# Altium project 练一练2.PrjPcb
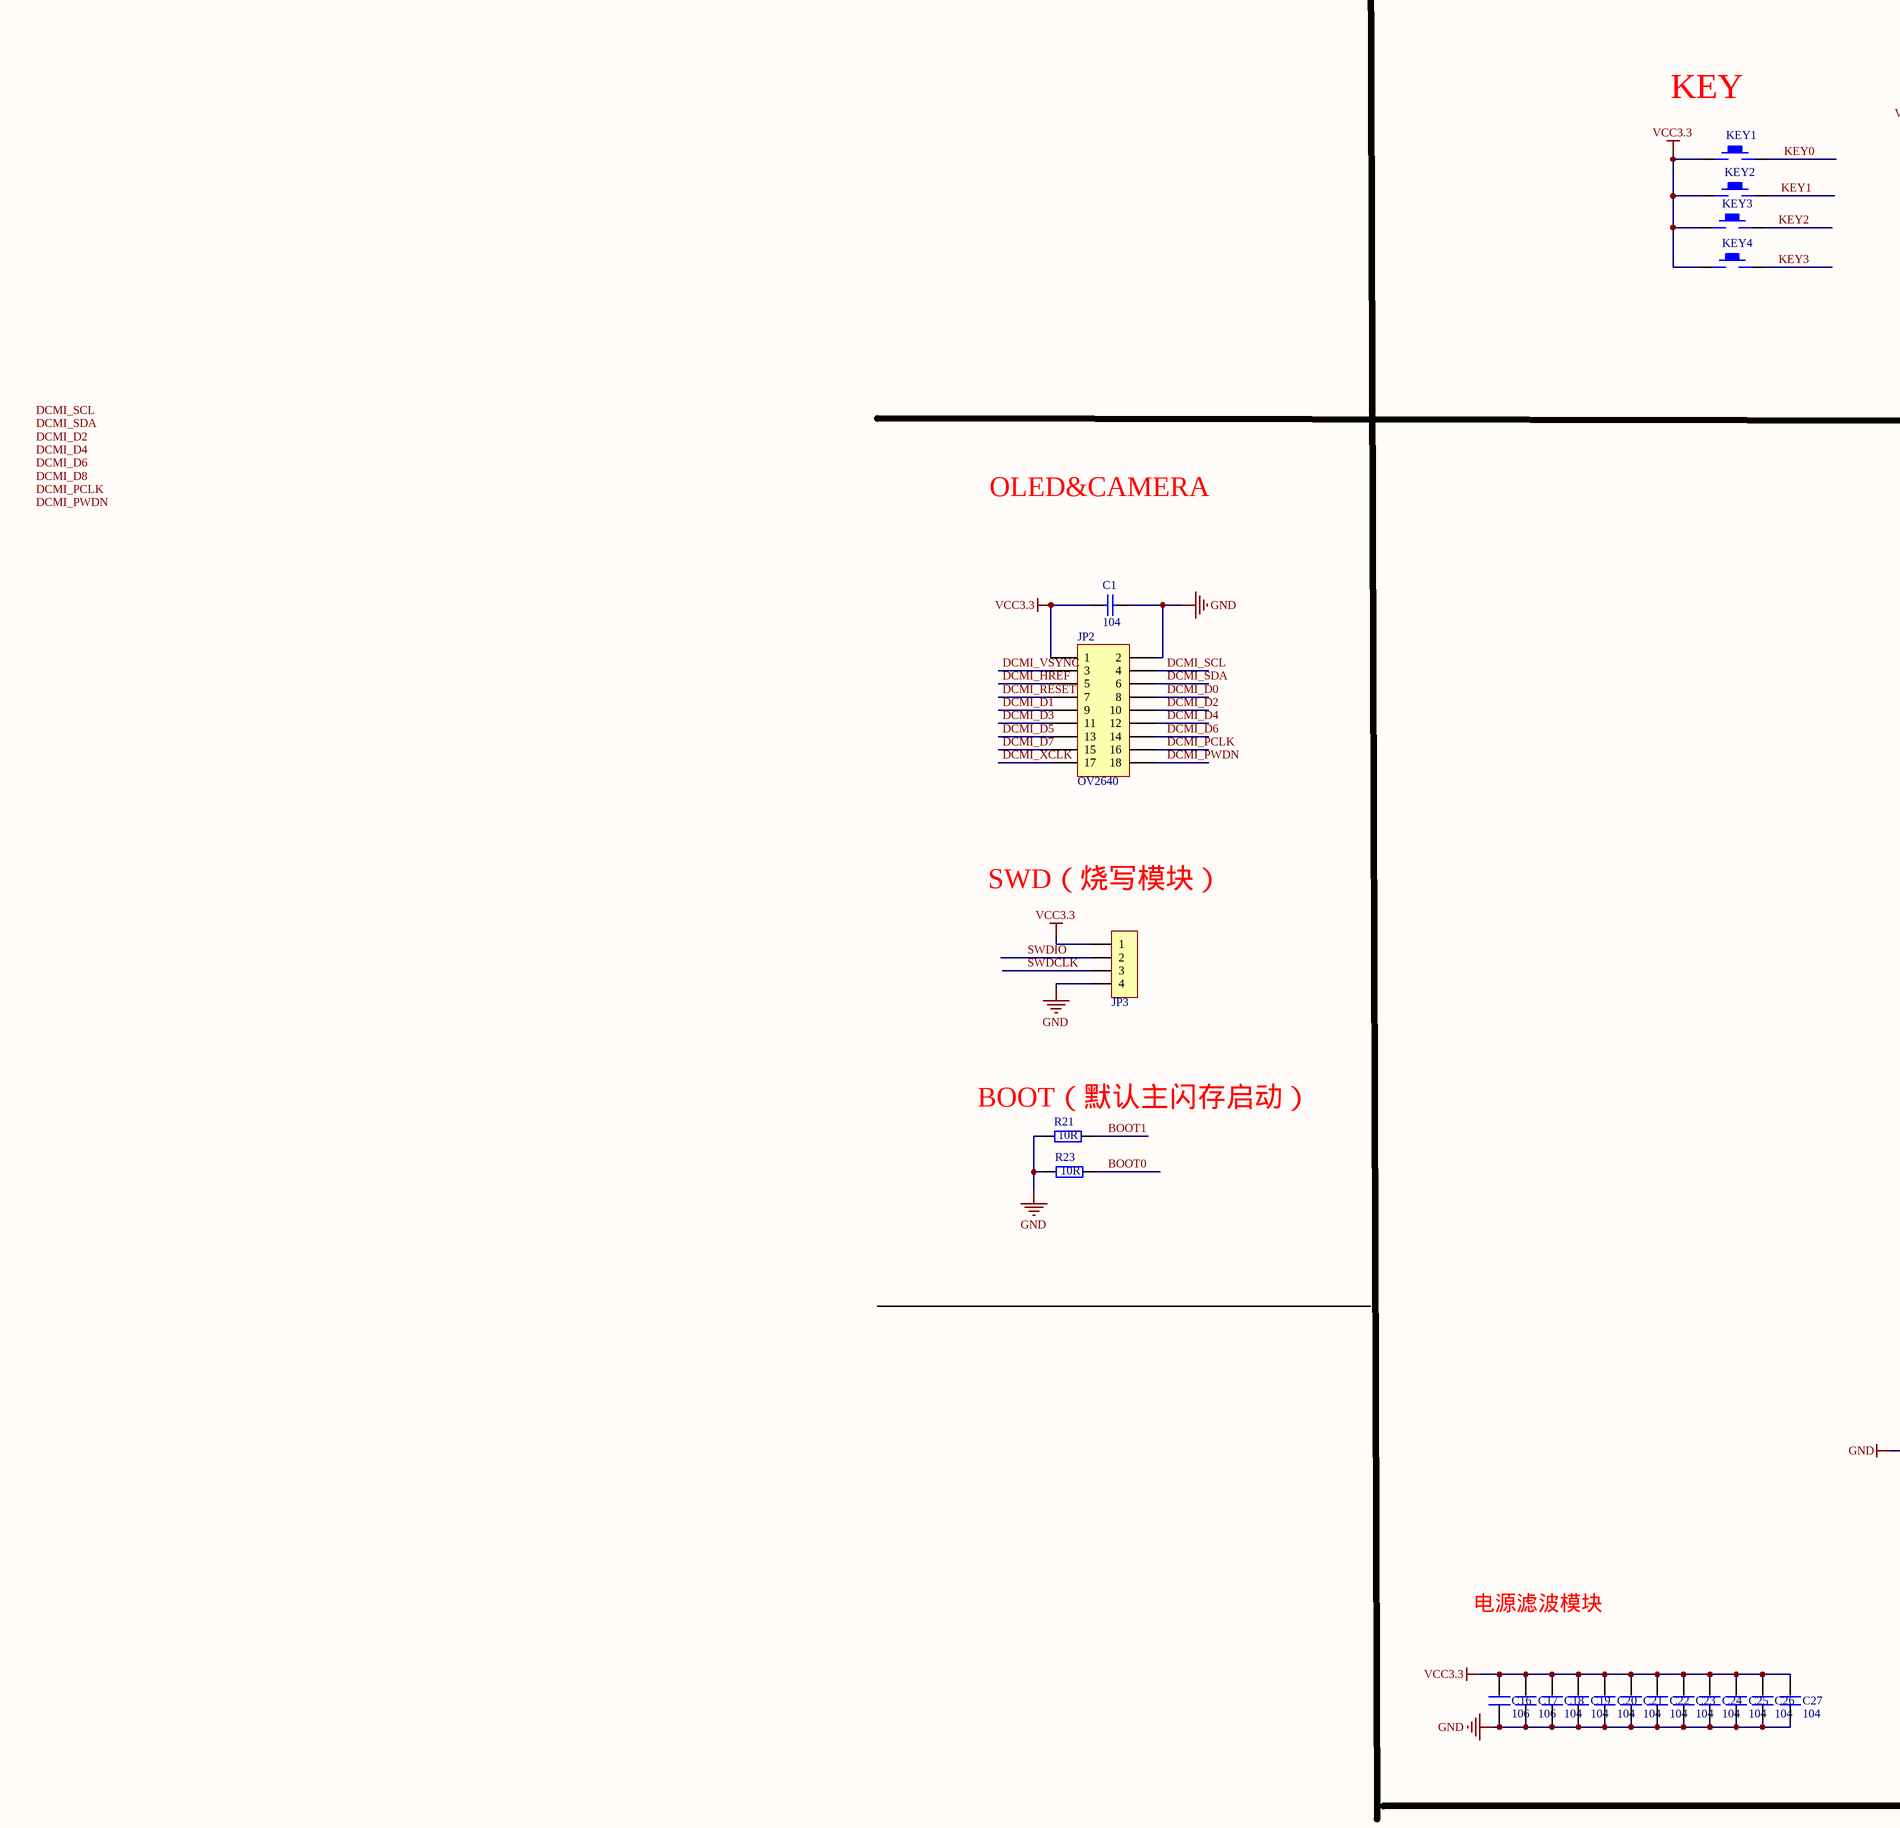
[diagram p0: 练一练2.SchDoc, left]
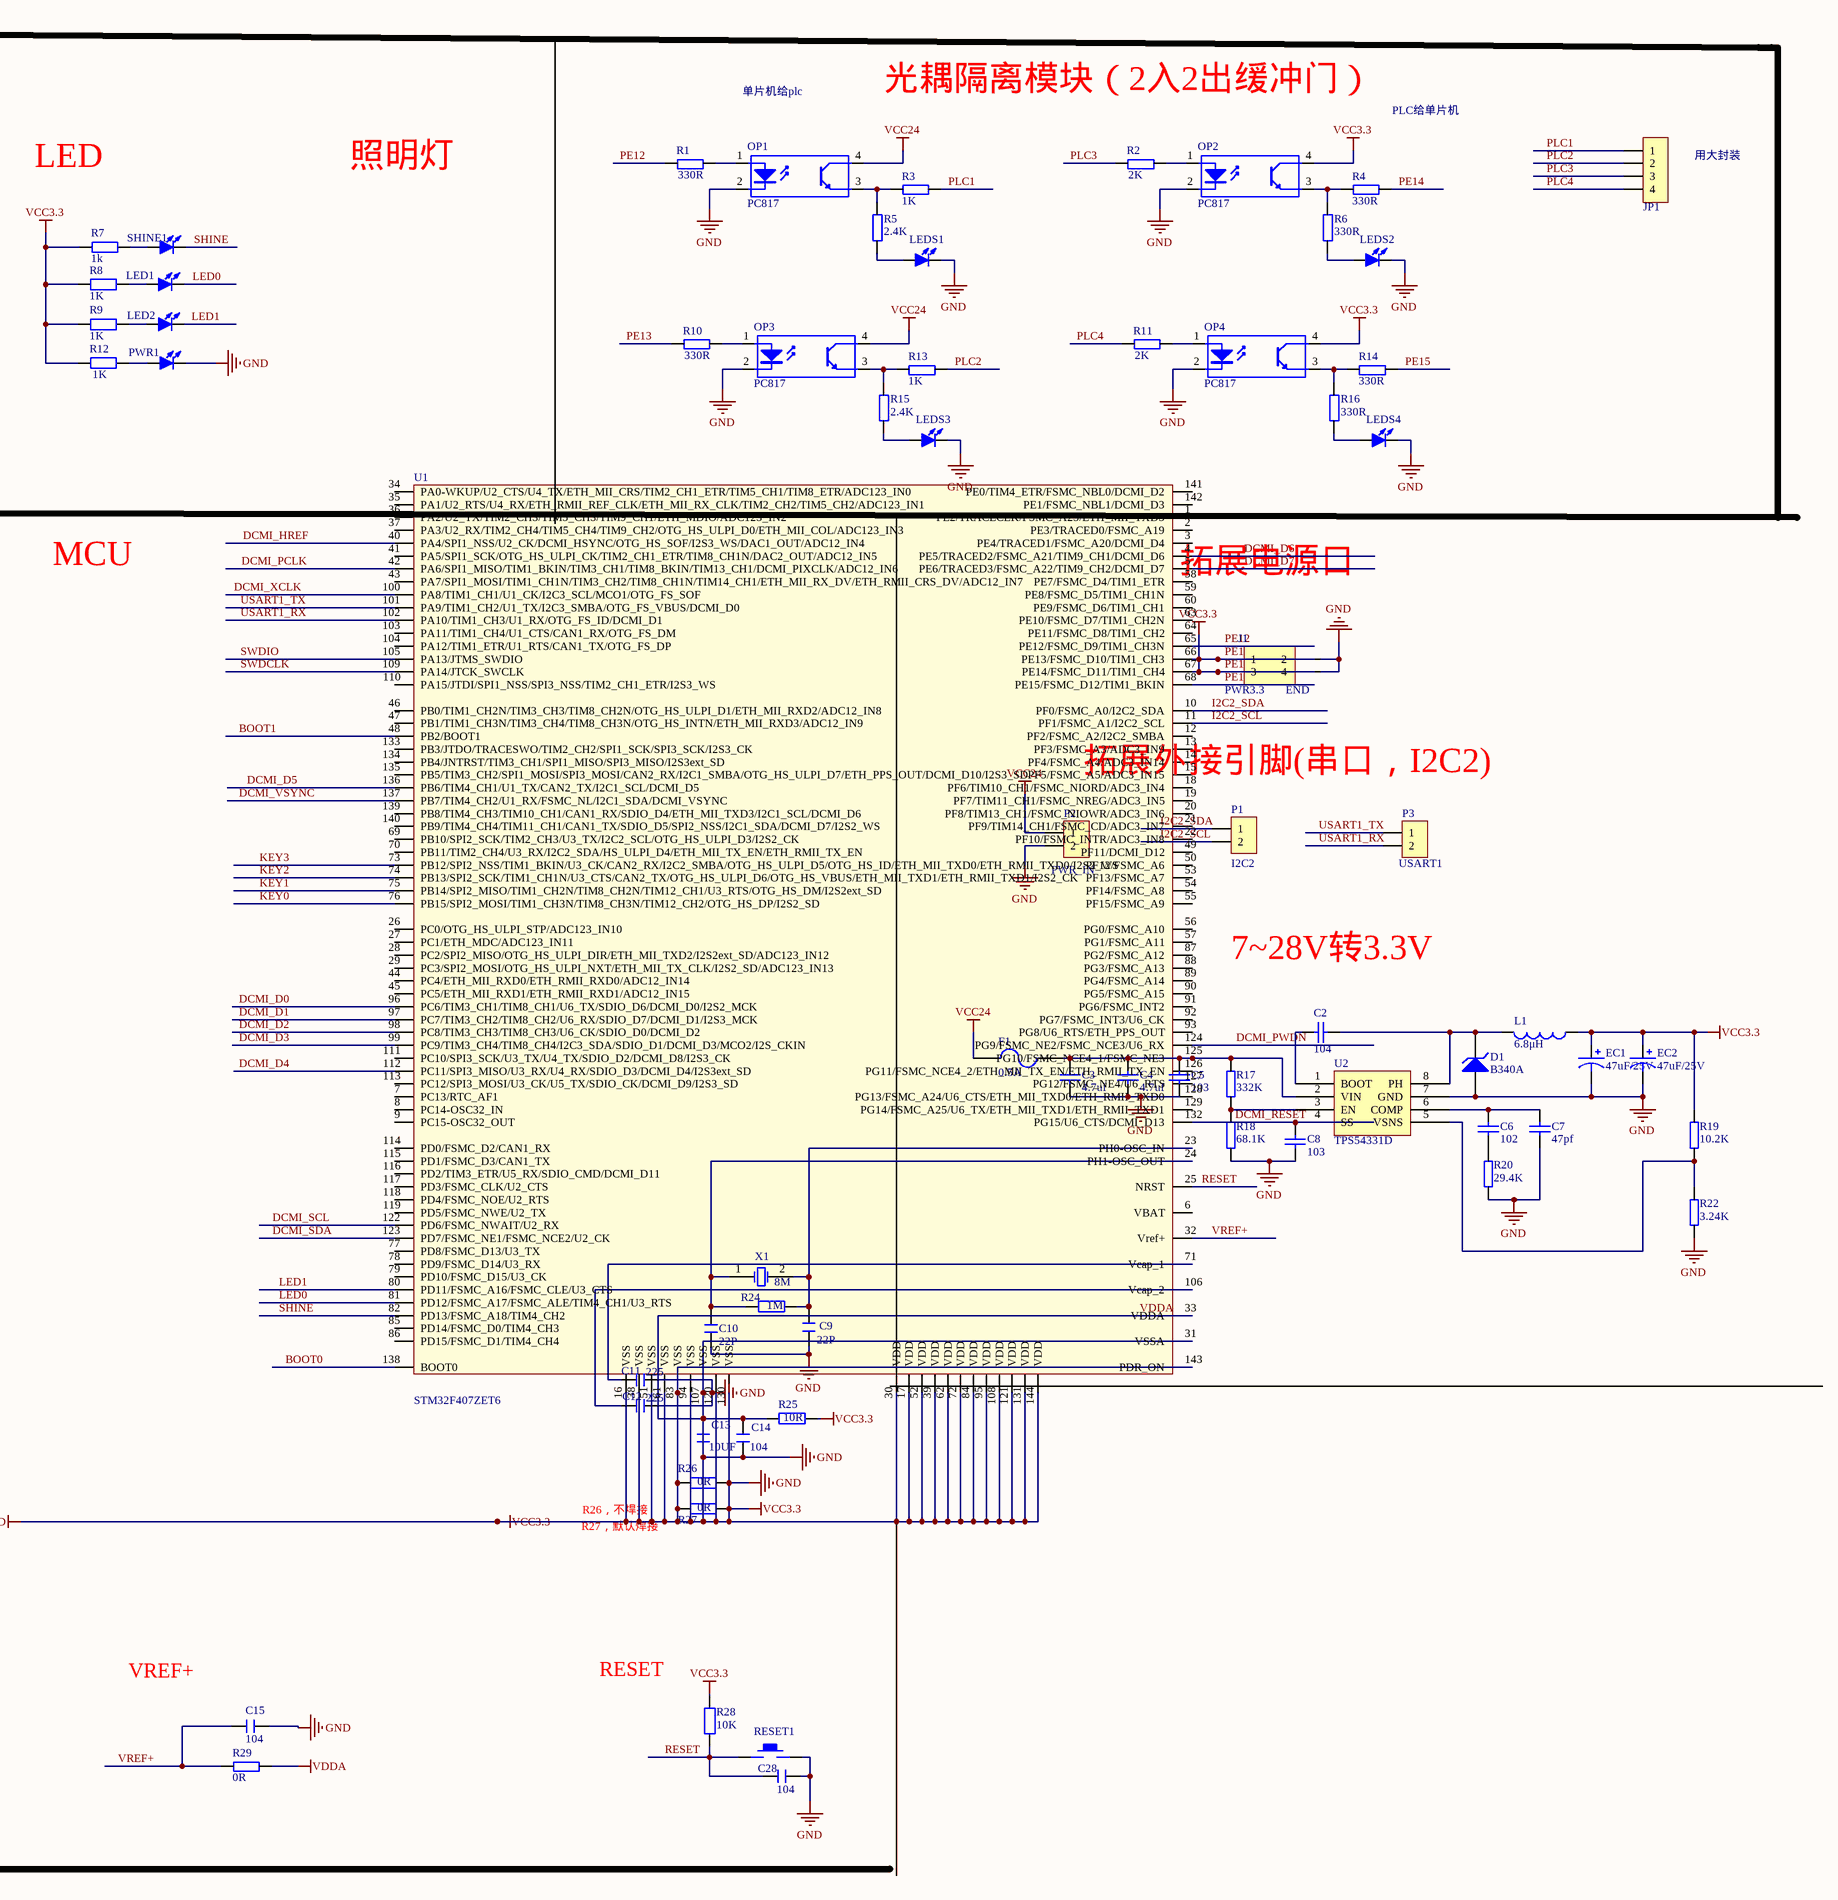
[diagram p1: 练一练2.SchDoc, right]
1 sheet, 89 parts. Net scope: global (net labels, ports and power ports of the same name join across sheets).
Board file: 练一练2.PcbDoc

## Sheet 练一练2.SchDoc
size A2

### Parts
C1  104  [C0805]
C2  104  [C0805]
C3  4.7uf  [C0805]
C4  4.7uf  [C0805]
C5  103  [C0805]
C6  102  [C0805]
C7  47pf  [C0805]
C8  103  [C0805]
C9  22P  [C 0805]
C10  22P  [C 0805]
C11  225  [C 0805]
C12  225  [C 0805]
C13  10UF  [C 0805]
C14  104  [C 0805]
C15  104  [C 0805]
C16  106  [C 0805]
C17  106  [C 0805]
C18  104  [C 0805]
C19  104  [C 0805]
C20  104  [C 0805]
C21  104  [C 0805]
C22  104  [C 0805]
C23  104  [C 0805]
C24  104  [C 0805]
C25  104  [C 0805]
C26  104  [C 0805]
C27  104  [C 0805]
C28  104  [C 0805]
D1  B340A  [SMA]
EC1  47uF/25V  [C-7]
EC2  47uF/25V  [C-7]
F1  0.5A  [FUSE0.5A]
J1  PWR3.3       END  [HDR2X2]
JP1  SWD  [IDC1X4-5.08]  (value not drawn)
JP2  OV2640  [HDR2X9]
JP3  SWD  [HDR1X4]  (value not drawn)
KEY1  KEY_M  [KEY-SMD1]  (value not drawn)
KEY2  KEY_M  [KEY-SMD1]  (value not drawn)
KEY3  KEY_M  [KEY-SMD1]  (value not drawn)
KEY4  KEY_M  [KEY-SMD1]  (value not drawn)
L1  6.8μH  [Hunter]
LED1  (no value)  [LED0805]
LED2  (no value)  [LED0805]
LEDS1  (no value)  [LED0805]
LEDS2  (no value)  [LED0805]
LEDS3  (no value)  [LED0805]
LEDS4  (no value)  [LED0805]
OP1  PC817  [SMD-4]
OP2  PC817  [SMD-4]
OP3  PC817  [SMD-4]
OP4  PC817  [SMD-4]
P1  I2C2  [HDR1X2]
P2  PWR_IN  [IDC1X2-5.08]
P3  USART1  [HDR1X2]
PWR1  (no value)  [LED0805]
R1  330R  [R0805]
R2  2K  [R0805]
R3  1K  [R0805]
R4  330R  [R0805]
R5  2.4K  [R0805]
R6  330R  [R0805]
R7  1k  [R0805]
R8  1K  [R0805]
R9  1K  [R0805]
R10  330R  [R0805]
R11  2K  [R0805]
R12  1K  [R 0805]
R13  1K  [R0805]
R14  330R  [R0805]
R15  2.4K  [R0805]
R16  330R  [R0805]
R17  332K  [R0805]
R18  68.1K  [R 0805]
R19  10.2K  [R 0805]
R20  29.4K  [R 0805]
R21  10R  [R 0805]
R22  3.24K  [R0805]
R23  10R  [R 0805]
R24  1M  [R 0805]
R25  10R  [R 0805]
R26  0R  [R 0805]
R27  0R  [R 0805]
R28  10K  [R 0805]
R29  0R  [R 0805]
RESET1  KEY_M  [KEY-SMD1]  (value not drawn)
SHINE1  (no value)  [LED0805]
U1  STM32F407ZET6  [LQFP144 20X20_M]
U2  TPS54331D  [SOP8DCDC]
X1  8M  [49/S_N]

### Nets
PE13: C1.1 C1.2 C3.2 C4.2 C5.2 C7.2 C8.2 C9.1 C10.1 C11.2 C12.2 C13.1 C13.2 C14.1 C14.2 C15.1 C16.1 C16.2 C17.1 C17.2 C18.1 C18.2 C19.1 C19.2 C20.1 C20.2 C21.1 C21.2 C22.1 C22.2 C23.1 C23.2 C24.1 C24.2 C25.1 C25.2 C26.1 C26.2 C27.1 C27.2 C28.1 D1.1(A) EC1.1 EC1.2 EC2.1 EC2.2 J1.1 J1.2 J1.3 J1.4 JP2.1 JP2.2 JP3.1 JP3.4 KEY1.1 KEY2.1 KEY3.1 KEY4.1 L1.1 LEDS1.2(K) LEDS2.2(K) LEDS3.2(K) LEDS4.2(K) OP1.2(K) OP2.2(K) OP2.4(C) OP3.2(K) OP4.2(K) OP4.4(C) P2.2 PWR1.2(K) R4.2 R7.1 R8.1 R9.1 R10.1 R12.1 R18.1 R19.2 R20.2 R21.1 R22.1 R23.1 R25.1 R25.2 R26.1 R26.2 R27.1 R27.2 R28.2 R29.2 RESET1.2 U1.16(VSS) U1.17(VDD) U1.30(VDD) U1.31(VSSA) U1.33(VDDA) U1.38(VSS) U1.39(VDD) U1.51(VSS) U1.52(VDD) U1.61(VSS) U1.62(VDD) U1.66(PE13/FSMC_D10/TIM1_CH3) U1.67(PE14/FSMC_D11/TIM1_CH4) U1.72(VDD) U1.83(VSS) U1.84(VDD) U1.94(VSS) U1.95(VDD) U1.107(VSS) U1.108(VDD) U1.120(VSS) U1.121(VDD) U1.130(VSS) U1.131(VDD) U1.143(PDR_ON) U1.144(VDD) U2.7(GND)  [also labelled GND, PE14, VCC3.3, VDDA]
VCC24: F1.1 OP1.4(C) OP3.4(C) P2.1
BOOT0: R23.2 U1.138(BOOT0)
BOOT1: R21.2 U1.48(PB2/BOOT1)
DCMI_D0: JP2.8 U1.96(PC6/TIM3_CH1/TIM8_CH1/U6_TX/SDIO_D6/DCMI_D0/I2S2_MCK)
DCMI_D1: JP2.9 U1.97(PC7/TIM3_CH2/TIM8_CH2/U6_RX/SDIO_D7/DCMI_D1/I2S3_MCK)
DCMI_D2: JP2.10 U1.98(PC8/TIM3_CH3/TIM8_CH3/U6_CK/SDIO_D0/DCMI_D2)
DCMI_D3: JP2.11 U1.99(PC9/TIM3_CH4/TIM8_CH4/I2C3_SDA/SDIO_D1/DCMI_D3/MCO2/I2S_CKIN)
DCMI_D4: JP2.12 U1.112(PC11/SPI3_MISO/U3_RX/U4_RX/SDIO_D3/DCMI_D4/I2S3ext_SD)
DCMI_D5: JP2.13 U1.136(PB6/TIM4_CH1/U1_TX/CAN2_TX/I2C1_SCL/DCMI_D5)
DCMI_D6: JP2.14 U1.4(PE5/TRACED2/FSMC_A21/TIM9_CH1/DCMI_D6)
DCMI_D7: JP2.15 U1.5(PE6/TRACED3/FSMC_A22/TIM9_CH2/DCMI_D7)
DCMI_HREF: JP2.5 U1.40(PA4/SPI1_NSS/U2_CK/DCMI_HSYNC/OTG_HS_SOF/I2S3_WS/DAC1_OUT/ADC12_IN4)
DCMI_PCLK: JP2.16 U1.42(PA6/SPI1_MISO/TIM1_BKIN/TIM3_CH1/TIM8_BKIN/TIM13_CH1/DCMI_PIXCLK/ADC12_IN6)
DCMI_PWDN: JP2.18 U1.124(PG9/FSMC_NE2/FSMC_NCE3/U6_RX)
DCMI_RESET: C8.1 JP2.7 U1.132(PG15/U6_CTS/DCMI_D13) U2.4(SS)
DCMI_SCL: JP2.4 U1.122(PD6/FSMC_NWAIT/U2_RX)
DCMI_SDA: JP2.6 U1.123(PD7/FSMC_NE1/FSMC_NCE2/U2_CK)
DCMI_VSYNC: JP2.3 U1.137(PB7/TIM4_CH2/U1_RX/FSMC_NL/I2C1_SDA/DCMI_VSYNC)
DCMI_XCLK: JP2.17 U1.100(PA8/TIM1_CH1/U1_CK/I2C3_SCL/MCO1/OTG_FS_SOF)
I2C2_SCL: P1.2 U1.11(PF1/FSMC_A1/I2C2_SCL)
I2C2_SDA: P1.1 U1.10(PF0/FSMC_A0/I2C2_SDA)
KEY0: KEY1.2 U1.76(PB15/SPI2_MOSI/TIM1_CH3N/TIM8_CH3N/TIM12_CH2/OTG_HS_DP/I2S2_SD)
KEY1: KEY2.2 U1.75(PB14/SPI2_MISO/TIM1_CH2N/TIM8_CH2N/TIM12_CH1/U3_RTS/OTG_HS_DM/I2S2ext_SD)
KEY2: KEY3.2 U1.74(PB13/SPI2_SCK/TIM1_CH1N/U3_CTS/CAN2_TX/OTG_HS_ULPI_D6/OTG_HS_VBUS/ETH_MII_TXD1/ETH_RMII_TXD1/I2S2_CK)
KEY3: KEY4.2 U1.73(PB12/SPI2_NSS/TIM1_BKIN/U3_CK/CAN2_RX/I2C2_SMBA/OTG_HS_ULPI_D5/OTG_HS_ID/ETH_MII_TXD0/ETH_RMII_TXD0/I2S2_WS)
LED0: LED1.2(K) U1.81(PD12/FSMC_A17/FSMC_ALE/TIM4_CH1/U3_RTS)
LED1: LED2.2(K) U1.80(PD11/FSMC_A16/FSMC_CLE/U3_CTS)
PE12: R1.1 U1.65(PE12/FSMC_D9/TIM1_CH3N)
PE15: R14.2 U1.68(PE15/FSMC_D12/TIM1_BKIN)
PLC1: JP1.1 R3.2
PLC2: JP1.2 R13.2
PLC3: JP1.3 R2.1
PLC4: JP1.4 R11.1
RESET: C28.2 R28.1 RESET1.1 U1.25(NRST)
SHINE: SHINE1.2(K) U1.82(PD13/FSMC_A18/TIM4_CH2)
SWDCLK: JP3.3 U1.109(PA14/JTCK_SWCLK)
SWDIO: JP3.2 U1.105(PA13/JTMS_SWDIO)
USART1_RX: P3.2 U1.102(PA10/TIM1_CH3/U1_RX/OTG_FS_ID/DCMI_D1)
USART1_TX: P3.1 U1.101(PA9/TIM1_CH2/U1_TX/I2C3_SMBA/OTG_FS_VBUS/DCMI_D0)
VREF+: C15.2 R29.1 U1.32(Vref+)
NetC2_1: C2.1 U2.1(BOOT)
NetC2_2: C2.2 D1.2(K) L1.2 U2.8(PH)
NetC3_1: C3.1 C4.1 C5.1 F1.2 R17.1 U1.125(PG10/FSMC_NCE4_1/FSMC_NE3) U2.2(VIN)
NetC6_1: C6.1 C7.1 U2.6(COMP)
NetC6_2: C6.2 R20.1
NetC9_2: C9.2 R24.2 U1.23(PH0-OSC_IN) X1.2(OSC2)
NetC10_2: C10.2 R24.1 U1.24(PH1-OSC_OUT) X1.1(OSC1)
NetC11_1: C11.1 U1.71(Vcap_1)
NetC12_1: C12.1 U1.106(Vcap_2)
NetLED1_1: LED1.1(A) R8.2
NetLED2_1: LED2.1(A) R9.2
NetLEDS1_1: LEDS1.1(A) R5.1
NetLEDS2_1: LEDS2.1(A) R6.1
NetLEDS3_1: LEDS3.1(A) R15.1
NetLEDS4_1: LEDS4.1(A) R16.1
NetOP1_1: OP1.1(A) R1.2
NetOP1_3: OP1.3(E) R3.1 R5.2
NetOP2_1: OP2.1(A) R2.2
NetOP2_3: OP2.3(E) R4.1 R6.2
NetOP3_1: OP3.1(A) R10.2
NetOP3_3: OP3.3(E) R13.1 R15.2
NetOP4_1: OP4.1(A) R11.2
NetOP4_3: OP4.3(E) R14.1 R16.2
NetPWR1_1: PWR1.1(A) R12.2
NetR7_2: R7.2 SHINE1.1(A)
NetR17_2: R17.2 R18.2 U2.3(EN)
NetR19_1: R19.1 R22.2 U2.5(VSNS)

Not connected (* = marked no-connect by the designer): U1 1(PE2/TRACECLK/FSMC_A23/ETH_MII_TXD3) 2(PE3/TRACED0/FSMC_A19) 3(PE4/TRACED1/FSMC_A20/DCMI_D4) 6(VBAT) 7(PC13/RTC_AF1) 8(PC14-OSC32_IN) 9(PC15-OSC32_OUT) 12(PF2/FSMC_A2/I2C2_SMBA) 13(PF3/FSMC_A3/ADC3_IN9) 14(PF4/FSMC_A4/ADC3_IN14) 15(PF5/FSMC_A5/ADC3_IN15) 18(PF6/TIM10_CH1/FSMC_NIORD/ADC3_IN4) 19(PF7/TIM11_CH1/FSMC_NREG/ADC3_IN5) 20(PF8/TIM13_CH1/FSMC_NIOWR/ADC3_IN6) 21(PF9/TIM14_CH1/FSMC_CD/ADC3_IN7) 22(PF10/FSMC_INTR/ADC3_IN8) 26(PC0/OTG_HS_ULPI_STP/ADC123_IN10) 27(PC1/ETH_MDC/ADC123_IN11) 28(PC2/SPI2_MISO/OTG_HS_ULPI_DIR/ETH_MII_TXD2/I2S2ext_SD/ADC123_IN12) 29(PC3/SPI2_MOSI/OTG_HS_ULPI_NXT/ETH_MII_TX_CLK/I2S2_SD/ADC123_IN13) 34(PA0-WKUP/U2_CTS/U4_TX/ETH_MII_CRS/TIM2_CH1_ETR/TIM5_CH1/TIM8_ETR/ADC123_IN0) 35(PA1/U2_RTS/U4_RX/ETH_RMII_REF_CLK/ETH_MII_RX_CLK/TIM2_CH2/TIM5_CH2/ADC123_IN1) 36(PA2/U2_TX/TIM2_CH3/TIM5_CH3/TIM9_CH1/ETH_MDIO/ADC123_IN2) 37(PA3/U2_RX/TIM2_CH4/TIM5_CH4/TIM9_CH2/OTG_HS_ULPI_D0/ETH_MII_COL/ADC123_IN3) 41(PA5/SPI1_SCK/OTG_HS_ULPI_CK/TIM2_CH1_ETR/TIM8_CH1N/DAC2_OUT/ADC12_IN5) 43(PA7/SPI1_MOSI/TIM1_CH1N/TIM3_CH2/TIM8_CH1N/TIM14_CH1/ETH_MII_RX_DV/ETH_RMII_CRS_DV/ADC12_IN7) 44(PC4/ETH_MII_RXD0/ETH_RMII_RXD0/ADC12_IN14) 45(PC5/ETH_MII_RXD1/ETH_RMII_RXD1/ADC12_IN15) 46(PB0/TIM1_CH2N/TIM3_CH3/TIM8_CH2N/OTG_HS_ULPI_D1/ETH_MII_RXD2/ADC12_IN8) 47(PB1/TIM1_CH3N/TIM3_CH4/TIM8_CH3N/OTG_HS_INTN/ETH_MII_RXD3/ADC12_IN9) 49(PF11/DCMI_D12) 50(PF12/FSMC_A6) 53(PF13/FSMC_A7) 54(PF14/FSMC_A8) 55(PF15/FSMC_A9) 56(PG0/FSMC_A10) 57(PG1/FSMC_A11) 58(PE7/FSMC_D4/TIM1_ETR) 59(PE8/FSMC_D5/TIM1_CH1N) 60(PE9/FSMC_D6/TIM1_CH1) 63(PE10/FSMC_D7/TIM1_CH2N) 64(PE11/FSMC_D8/TIM1_CH2) 69(PB10/SPI2_SCK/TIM2_CH3/U3_TX/I2C2_SCL/OTG_HS_ULPI_D3/I2S2_CK) 70(PB11/TIM2_CH4/U3_RX/I2C2_SDA/HS_ULPI_D4/ETH_MII_TX_EN/ETH_RMII_TX_EN) 77(PD8/FSMC_D13/U3_TX) 78(PD9/FSMC_D14/U3_RX) 79(PD10/FSMC_D15/U3_CK) 85(PD14/FSMC_D0/TIM4_CH3) 86(PD15/FSMC_D1/TIM4_CH4) 87(PG2/FSMC_A12) 88(PG3/FSMC_A13) 89(PG4/FSMC_A14) 90(PG5/FSMC_A15) 91(PG6/FSMC_INT2) 92(PG7/FSMC_INT3/U6_CK) 93(PG8/U6_RTS/ETH_PPS_OUT) 103(PA11/TIM1_CH4/U1_CTS/CAN1_RX/OTG_FS_DM) 104(PA12/TIM1_ETR/U1_RTS/CAN1_TX/OTG_FS_DP) 110(PA15/JTDI/SPI1_NSS/SPI3_NSS/TIM2_CH1_ETR/I2S3_WS) 111(PC10/SPI3_SCK/U3_TX/U4_TX/SDIO_D2/DCMI_D8/I2S3_CK) 113(PC12/SPI3_MOSI/U3_CK/U5_TX/SDIO_CK/DCMI_D9/I2S3_SD) 114(PD0/FSMC_D2/CAN1_RX) 115(PD1/FSMC_D3/CAN1_TX) 116(PD2/TIM3_ETR/U5_RX/SDIO_CMD/DCMI_D11) 117(PD3/FSMC_CLK/U2_CTS) 118(PD4/FSMC_NOE/U2_RTS) 119(PD5/FSMC_NWE/U2_TX) 126(PG11/FSMC_NCE4_2/ETH_MII_TX_EN/ETH_RMII_TX_EN) 127(PG12/FSMC_NE4/U6_RTS) 128(PG13/FSMC_A24/U6_CTS/ETH_MII_TXD0/ETH_RMII_TXD0) 129(PG14/FSMC_A25/U6_TX/ETH_MII_TXD1/ETH_RMII_TXD1) 133(PB3/JTDO/TRACESWO/TIM2_CH2/SPI1_SCK/SPI3_SCK/I2S3_CK) 134(PB4/JNTRST/TIM3_CH1/SPI1_MISO/SPI3_MISO/I2S3ext_SD) 135(PB5/TIM3_CH2/SPI1_MOSI/SPI3_MOSI/CAN2_RX/I2C1_SMBA/OTG_HS_ULPI_D7/ETH_PPS_OUT/DCMI_D10/I2S3_SD) 139(PB8/TIM4_CH3/TIM10_CH1/CAN1_RX/SDIO_D4/ETH_MII_TXD3/I2C1_SCL/DCMI_D6) 140(PB9/TIM4_CH4/TIM11_CH1/CAN1_TX/SDIO_D5/SPI2_NSS/I2C1_SDA/DCMI_D7/I2S2_WS) 141(PE0/TIM4_ETR/FSMC_NBL0/DCMI_D2) 142(PE1/FSMC_NBL1/DCMI_D3)

### Notes on the sheet
- 单片机给plc
- 光耦隔离模块（2入2出缓冲门）
- PLC给单片机
- 用大封装
- (near KEY1) KEY
- LED
- 照明灯
- OLED&CAMERA
- MCU
- (near U1) 拓展电源口
- (near U1) 拓展外接引脚(串口，I2C2)
- (near JP3) SWD（烧写模块）
- 7~28V转3.3V
- (near R21) BOOT（默认主闪存启动）
- R26，不焊接
- R27，默认焊接
- 电源滤波模块
- VREF+
- RESET
- Labels drawn without touching a wire or pin: DCMI_D2, DCMI_D4, DCMI_D6, DCMI_D8, DCMI_PCLK, DCMI_PWDN, DCMI_SCL, DCMI_SDA

### Library data of the parts
C1-C8 = Cap0: Default Capacitor; Published: 8-Jun-2000; LatestRevisionDate: 17-Jul-2002; LatestRevisionNote: Re-released for DXP Platform.; PackageReference: RAD-0.3; Publisher: Altium Limited
C9-C15 C28 = C: 无极性贴片电容; 版权归属: 源创客; 材质: X7R; BOM名称: 无极性贴片电容; 学习资源: www.ooocke.com
C16-C27 = C
D1 = D Zener: 瞬态抑制二极管; Published: 8-Jun-2000; LatestRevisionDate: 17-Jul-2002; LatestRevisionNote: Re-released for DXP Platform.; PackageReference: DIODE-0.7; Publisher: Altium Limited; PackageDescription: Diode, Thru-Hole; 2 Leads; 0.7 in Pin Spacing
EC1 EC2 = Cap2: Polarized Capacitor (Axial); Published: 8-Jun-2000; LatestRevisionDate: 17-Jul-2002; LatestRevisionNote: Re-released for DXP Platform.; PackageReference: POLAR0.8; Publisher: Altium Limited; PackageDescription: Polarized Capacitor; 2 Leads
F1 = Fuse1: Fuse; Published: 8-Jun-2000; LatestRevisionDate: 17-Jul-2002; LatestRevisionNote: Re-released for DXP Platform.; PackageReference: PIN-W2/E2.8; Publisher: Altium Limited; PackageDescription: Thru-Hole; 2 Leads
J1 = Header 2X2: Header, 2-Pin, Dual row; LatestRevisionDate: 17-Jul-2002; LatestRevisionNote: Re-released for DXP Platform.; Publisher: Altium Limited
JP1 JP3 = Header 4: 4P接插件; 版权归属: 源创客; BOM名称: 4P接插件; 学习资源: www.ooocke.com
JP2 = Header 9X2: Header, 9-Pin, Dual row; LatestRevisionDate: 17-Jul-2002; LatestRevisionNote: Re-released for DXP Platform.; Publisher: Altium Limited
L1 = Inductor: Code_IEC: 1005; Published: 8-Jun-2000; LatestRevisionDate: 17-Jul-2002; LatestRevisionNote: Re-released for DXP Platform.; PackageReference: 0402-A; Publisher: Altium Limited; Code_JEITA: 0402
LED1 LED2 LEDS1-LEDS4 PWR1 SHINE1 = LED-SMD: 贴片LED; 版权归属: 源创客; BOM名称: 贴片LED; 学习资源: www.ooocke.com
OP1-OP4 = Optoisolator: 4-Pin Phototransistor Optocoupler; Published: 24-Mar-1999; LatestRevisionDate: 04-Mar-2005; LatestRevisionNote: Sch pins 3 & 4 Swapped.; DatasheetDocument: Nov-2003; PackageReference: DIP-4; Publisher: Altium Limited
P1-P3 = Header 1x2
R1 R2 R10 R11 = R_1
R3-R6 R13-R16 = R_3
R7-R9 R12 R21 R23-R28 = R: 贴片电阻; 版权归属: 源创客; BOM名称: 贴片电阻; 学习资源: www.ooocke.com
R17-R20 R22 = Res0: default resistor
R29 = R
U2 = TPS54331DDAR
X1 = XTAL: Crystal Oscillator; Published: *; LatestRevisionDate: *; LatestRevisionNote: *; Publisher: *